# Altium schematic sheet Embeded MCU.SchDoc: Processing interface
size A4; Author: Maxime Tousignant-Tremblay; Revision: 1; SheetNumber: 1; SheetTotal: 5
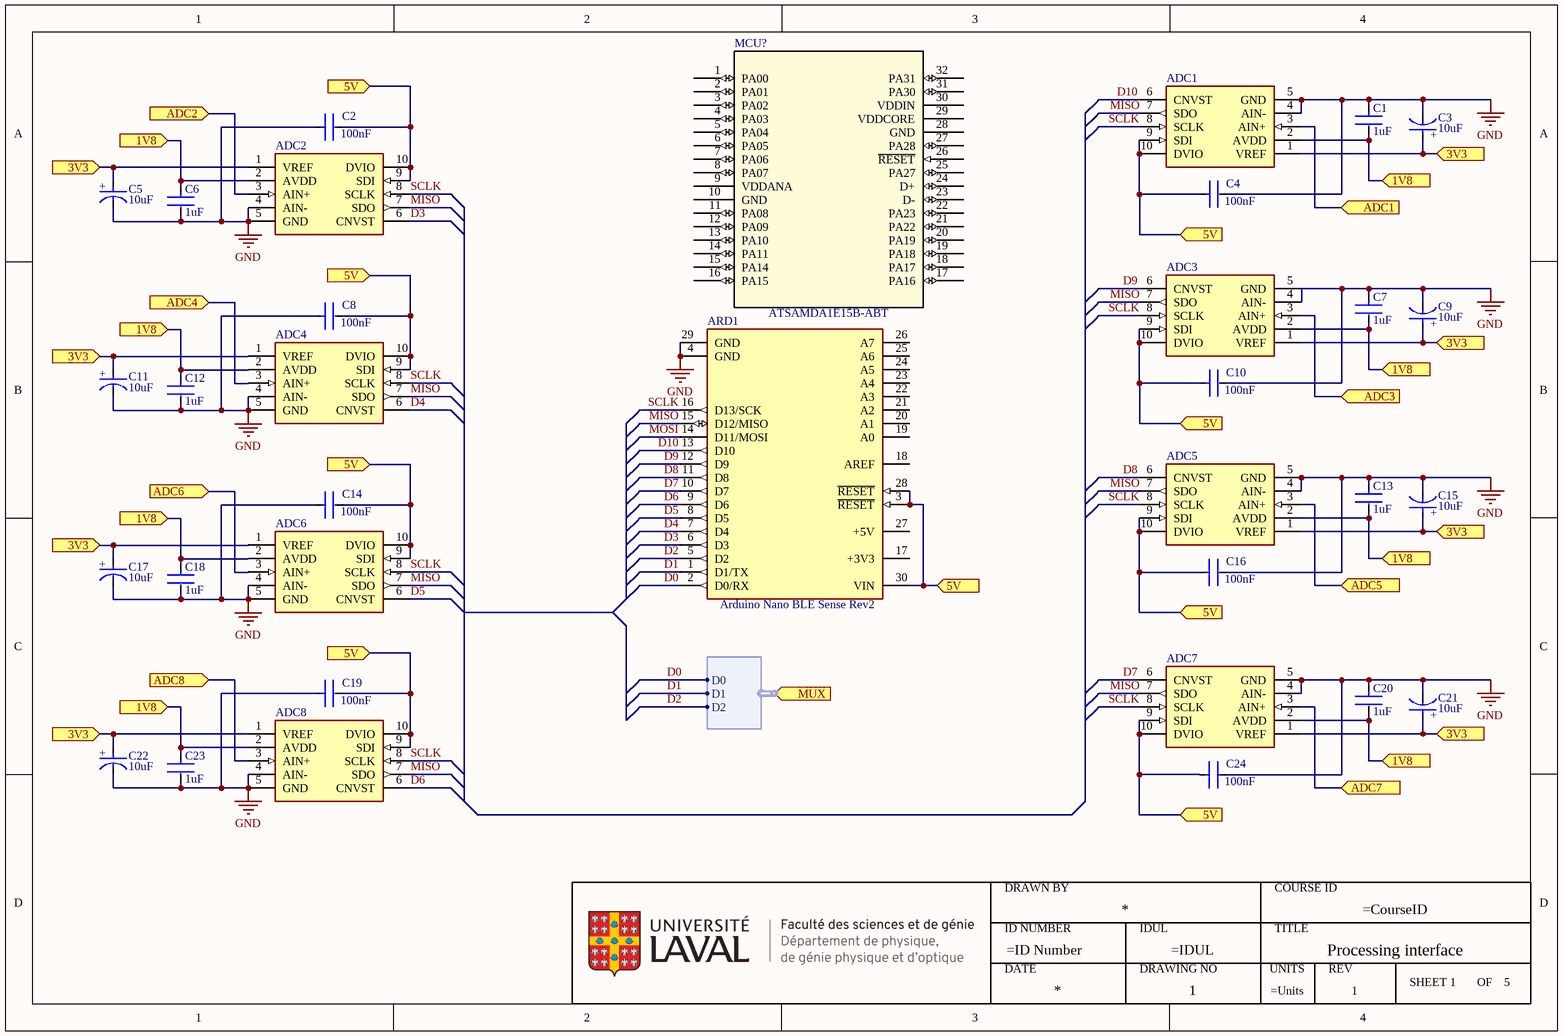
[diagram p0: Embeded MCU.SchDoc]

## Parts
*1  ULaval FSG-DPGPO  (value not drawn)  (graphical)
ADC1  MCP33141-10-E/MS  [MCP33141-10-E/MS]  (value not drawn)
ADC2  MCP33141-10-E/MS  [MCP33141-10-E/MS]  (value not drawn)
ADC3  MCP33141-10-E/MS  [MCP33141-10-E/MS]  (value not drawn)
ADC4  MCP33141-10-E/MS  [MCP33141-10-E/MS]  (value not drawn)
ADC5  MCP33141-10-E/MS  [MCP33141-10-E/MS]  (value not drawn)
ADC6  MCP33141-10-E/MS  [MCP33141-10-E/MS]  (value not drawn)
ADC7  MCP33141-10-E/MS  [MCP33141-10-E/MS]  (value not drawn)
ADC8  MCP33141-10-E/MS  [MCP33141-10-E/MS]  (value not drawn)
ARD1  Arduino Nano BLE Sense Rev2  [Arduino Nano BLE Sense Rev2 with Headers-Footprint-1]  (no BOM)
C1  value 1uF  [FP-CC0603-DA-IPC_B]  (hidden comment: CC0603KPX7R7BB105)
C2  value 100nF  [FP-CC0603-DA-IPC_B]  (hidden comment: CC0603JRX7R9BB104)
C3  value 10uF  [FP-293D-B-MFG]  (hidden comment: 293D106X9016B2TE3)
C4  value 100nF  [FP-CC0603-DA-IPC_B]  (hidden comment: CC0603JRX7R9BB104)
C5  value 10uF  [FP-293D-B-MFG]  (hidden comment: 293D106X9016B2TE3)
C6  value 1uF  [FP-CC0603-DA-IPC_B]  (hidden comment: CC0603KPX7R7BB105)
C7  value 1uF  [FP-CC0603-DA-IPC_B]  (hidden comment: CC0603KPX7R7BB105)
C8  value 100nF  [FP-CC0603-DA-IPC_B]  (hidden comment: CC0603JRX7R9BB104)
C9  value 10uF  [FP-293D-B-MFG]  (hidden comment: 293D106X9016B2TE3)
C10  value 100nF  [FP-CC0603-DA-IPC_B]  (hidden comment: CC0603JRX7R9BB104)
C11  value 10uF  [FP-293D-B-MFG]  (hidden comment: 293D106X9016B2TE3)
C12  value 1uF  [FP-CC0603-DA-IPC_B]  (hidden comment: CC0603KPX7R7BB105)
C13  value 1uF  [FP-CC0603-DA-IPC_B]  (hidden comment: CC0603KPX7R7BB105)
C14  value 100nF  [FP-CC0603-DA-IPC_B]  (hidden comment: CC0603JRX7R9BB104)
C15  value 10uF  [FP-293D-B-MFG]  (hidden comment: 293D106X9016B2TE3)
C16  value 100nF  [FP-CC0603-DA-IPC_B]  (hidden comment: CC0603JRX7R9BB104)
C17  value 10uF  [FP-293D-B-MFG]  (hidden comment: 293D106X9016B2TE3)
C18  value 1uF  [FP-CC0603-DA-IPC_B]  (hidden comment: CC0603KPX7R7BB105)
C19  value 100nF  [FP-CC0603-DA-IPC_B]  (hidden comment: CC0603JRX7R9BB104)
C20  value 1uF  [FP-CC0603-DA-IPC_B]  (hidden comment: CC0603KPX7R7BB105)
C21  value 10uF  [FP-293D-B-MFG]  (hidden comment: 293D106X9016B2TE3)
C22  value 10uF  [FP-293D-B-MFG]  (hidden comment: 293D106X9016B2TE3)
C23  value 1uF  [FP-CC0603-DA-IPC_B]  (hidden comment: CC0603KPX7R7BB105)
C24  value 100nF  [FP-CC0603-DA-IPC_B]  (hidden comment: CC0603JRX7R9BB104)
MCU?  ATSAMDA1E15B-ABT  [TQFP32_MC_MCH]

## Ports
1V8 (in), 3V3 (in), 5V (in), ADC1 (in), ADC2 (in), ADC3 (in), ADC4 (in), ADC5 (in), ADC6 (in), ADC7 (in), ADC8 (in), MUX (in, harness *)

## Harnesses
*: D0, D1, D2

## Nets
GND: ADC1.4(AIN-) ADC1.5(GND) ADC2.4(AIN-) ADC2.5(GND) ADC3.4(AIN-) ADC3.5(GND) ADC4.4(AIN-) ADC4.5(GND) ADC5.4(AIN-) ADC5.5(GND) ADC6.4(AIN-) ADC6.5(GND) ADC7.4(AIN-) ADC7.5(GND) ADC8.4(AIN-) ADC8.5(GND) ARD1.4(GND) ARD1.29(GND) C1.1 C2.1 C3.1(C) C4.2 C5.1(C) C6.2 C7.1 C8.1 C9.1(C) C10.2 C11.1(C) C12.2 C13.1 C14.1 C15.1(C) C16.2 C17.1(C) C18.2 C19.1 C20.1 C21.1(C) C22.1(C) C23.2 C24.2
1V8: ADC1.2(AVDD) ADC2.2(AVDD) ADC3.2(AVDD) ADC4.2(AVDD) ADC5.2(AVDD) ADC6.2(AVDD) ADC7.2(AVDD) ADC8.2(AVDD) C1.2 C6.1 C7.2 C12.1 C13.2 C18.1 C20.2 C23.1 ; port 1V8
3V3: ADC1.1(VREF) ADC2.1(VREF) ADC3.1(VREF) ADC4.1(VREF) ADC5.1(VREF) ADC6.1(VREF) ADC7.1(VREF) ADC8.1(VREF) C3.2(A) C5.2(A) C9.2(A) C11.2(A) C15.2(A) C17.2(A) C21.2(A) C22.2(A) ; port 3V3
5V: ADC1.9(SDI) ADC1.10(DVIO) ADC2.9(SDI) ADC2.10(DVIO) ADC3.9(SDI) ADC3.10(DVIO) ADC4.9(SDI) ADC4.10(DVIO) ADC5.9(SDI) ADC5.10(DVIO) ADC6.9(SDI) ADC6.10(DVIO) ADC7.9(SDI) ADC7.10(DVIO) ADC8.9(SDI) ADC8.10(DVIO) ARD1.3(~{RESET}) ARD1.28(~{RESET}) ARD1.30(VIN) C2.2 C4.1 C8.2 C10.1 C14.2 C16.1 C19.2 C24.1 ; port 5V
ADC1: ADC1.3(AIN+) ; port ADC1
ADC2: ADC2.3(AIN+) ; port ADC2
ADC3: ADC3.3(AIN+) ; port ADC3
ADC4: ADC4.3(AIN+) ; port ADC4
ADC5: ADC5.3(AIN+) ; port ADC5
ADC6: ADC6.3(AIN+) ; port ADC6
ADC7: ADC7.3(AIN+) ; port ADC7
ADC8: ADC8.3(AIN+) ; port ADC8
D0: ARD1.2(D0/RX) ; port MUX.D0
D1: ARD1.1(D1/TX) ; port MUX.D1
D2: ARD1.5(D2) ; port MUX.D2
D3: ADC2.6(CNVST) ARD1.6(D3)
D4: ADC4.6(CNVST) ARD1.7(D4)
D5: ADC6.6(CNVST) ARD1.8(D5)
D6: ADC8.6(CNVST) ARD1.9(D6)
D7: ADC7.6(CNVST) ARD1.10(D7)
D8: ADC5.6(CNVST) ARD1.11(D8)
D9: ADC3.6(CNVST) ARD1.12(D9)
D10: ADC1.6(CNVST) ARD1.13(D10)
MISO: ADC1.7(SDO) ADC2.7(SDO) ADC3.7(SDO) ADC4.7(SDO) ADC5.7(SDO) ADC6.7(SDO) ADC7.7(SDO) ADC8.7(SDO) ARD1.15(D12/MISO)
MOSI: ARD1.14(D11/MOSI)
SCLK: ADC1.8(SCLK) ADC2.8(SCLK) ADC3.8(SCLK) ADC4.8(SCLK) ADC5.8(SCLK) ADC6.8(SCLK) ADC7.8(SCLK) ADC8.8(SCLK) ARD1.16(D13/SCK)

Not connected (* = marked no-connect by the designer): ARD1 17(+3V3) 18(AREF) 19(A0) 20(A1) 21(A2) 22(A3) 23(A4) 24(A5) 25(A6) 26(A7) 27(+5V); MCU? 1(PA00) 2(PA01) 3(PA02) 4(PA03) 5(PA04) 6(PA05) 7(PA06) 8(PA07) 9(VDDANA) 10(GND) 11(PA08) 12(PA09) 13(PA10) 14(PA11) 15(PA14) 16(PA15) 17(PA16) 18(PA17) 19(PA18) 20(PA19) 21(PA22) 22(PA23) 23(D-) 24(D+) 25(PA27) 26(~{RESET}) 27(PA28) 28(GND) 29(VDDCORE) 30(VDDIN) 31(PA30) 32(PA31)

## Notes on the sheet
- (in symbol CMP-001-00090-1) +
- (in symbol ULaval FSG-DPGPO) DRAWN BY; COURSE ID; ID NUMBER; IDUL; TITLE; DATE; DRAWING NO; UNITS; REV; SHEET; OF

## Library data of the parts
ADC1-ADC8 = CMP-020-00028-10: ADC Single SAR 1Msps 12-bit Serial Microwire/SPI 10-Pin MSOP Tray; Resolution: 12 Bits; Sampling rate: 1M; Data Interface: SPI; Architecture: SAR
ARD1 = CMP-000000-1: ABX00069, nRF52840 64MHz, 256 KB SRAM, 1MB flash, 14 I/O pins, 8 Analog inputs; DC current per I/O pin: 10mA; Input voltage (nominal): 5-18V; I/O voltage: 3.3V; Weight: 5g; Clock speed: 64MHz; Width: 18mm; Length: 45mm
C1 C6 C7 C12 C13 C18 C20 C23 = CMP-001-00101-1: 0603 1 uF 16 V ±10 % Tolerance X7R SMT Multilayer Ceramic Capacitor; Tolerance: 10%; Voltage Rating (DC): 16V; Construction: Flat; Case Code (Imperial): 0603; Height: 0.8mm; Max Operating Temperature: 125°C; Termination: SMD/SMT; Mounting Technology: Surface Mount; Packaging: Tape and Reel; RoHS Compliant: Yes; Dielectric: X7R; Length: 1.6mm; Halogen Free: Halogen Free; Min Operating Temperature: -55°C; Case Code (Metric): 1608; Lead Free: Lead Free; Radiation Hardening: No; Case/Package: 0603; Depth: 0.8mm; Weight: 7.1E-05oz; Resistor Type: Ceramic
C2 C4 C8 C10 C14 C16 C19 C24 = CMP-001-00097-1: 0603 0.1 uF 50 V ±5 % Tolerance X7R SMT Multilayer Ceramic Capacitor; Voltage Rating: 50V; Tolerance: 5%; Halogen Free: Halogen Free; Depth: 0.8mm; Case/Package: 0603; Dielectric: X7R; Thickness: 0.035inch; Series: CC; Termination: SMD/SMT; Voltage Rating (DC): 50V; Max Operating Temperature: 125°C; Weight: 7.1E-05oz; Construction: Flat; Resistor Type: Ceramic; Height: 0.8mm; Length: 0.063inch; RoHS Compliant: Yes; Lead Free: Lead Free; Pins: 2; Min Operating Temperature: -55°C; Case Code (Imperial): 0603; Radiation Hardening: No; Case Code (Metric): 1608; Mounting Technology: Surface Mount; Width: 0.031inch; Packaging: Tape and Reel
C3 C5 C9 C11 C15 C17 C21 C22 = CMP-001-00090-1: Cap Tant Solid 10uF 16V B CASE 10% (3.5 X 2.8 X 1.9mm) Inward L SMD 3528-21 2 Ohm 125C T/R; ESR (Equivalent Series Resistance): 2R; Ripple Current: 160mA; Dielectric Material: Tantalum; Q Factor: 6; Polarity: Polar; Dissipation Factor: 6%; Leakage Current: 1.6uA; Termination: SMD/SMT; Package Quantity: 2000; RoHS Compliant: Yes; Min Operating Temperature: -55°C; Lead Free: Lead Free; Length: 3.5mm; Tolerance: 10%; Height: 1.9mm; Construction: Flat; Voltage: 16V; Height - Seated (Max): 0.083inch; Voltage Rating (DC): 16V; Features: General Purpose; Packaging: Tape and Reel; Voltage Rating: 16V; Case Code (Imperial): 1411; Case/Package: 1411; Width: 1.9mm; Max Operating Temperature: 125°C; Mounting Technology: Surface Mount,PCB; Case Code (Metric): 3528; Series: TANTAMOUNT®, 293D; Depth: 2.8mm; Radiation Hardening: No
MCU? = ATSAMDA1E15B-ABT: ARM® Cortex®-M0+ SAM DA1, Functional Safety (FuSa) Microcontroller IC 32-Bit Single-Core 48MHz 32KB (32K x 8) FLASH 32-TQFP (7x7); Mfr_Name: Microchip; Copyright: Copyright (C) 2023 Ultra Librarian. All rights reserved.; Manufacturer_Part_Number: ATSAMDA1E15B-ABT; RefDes: RefDes; Type: DEV; Supplier 1: Mouser; Supplier Part Number 1: 556-ATSAMDA1E15B-ABT